# EAGLE design bbf-eurojacks (EAGLE 9.6.2)
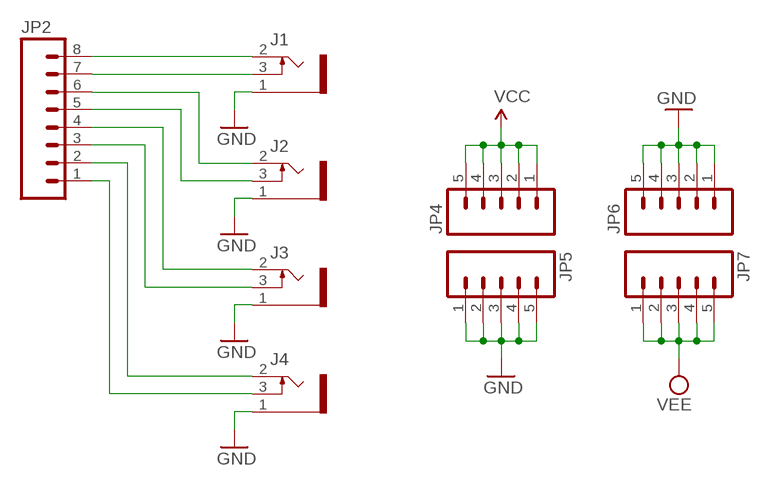
[diagram p0: schematic, sheet 1]

## Parts
J1  1502_03SLOTTED  [1502_03_SLOTTED]
J2  1502_03SLOTTED  [1502_03_SLOTTED]
J3  1502_03SLOTTED  [1502_03_SLOTTED]
J4  1502_03SLOTTED  [1502_03_SLOTTED]
JP2  M08  [1X08]
JP4  M05PTH  [1X05]
JP5  M05PTH  [1X05]
JP6  M05PTH  [1X05]
JP7  M05PTH  [1X05]

## Nets
GND: J1.1 J2.1 J3.1 J4.1 JP5.1 JP5.2 JP5.3 JP5.4 JP5.5 JP6.1 JP6.2 JP6.3 JP6.4 JP6.5
N$1: J2.2 JP2.6
N$2: J2.3 JP2.5
N$3: J3.2 JP2.4
N$4: J3.3 JP2.3
N$5: J4.2 JP2.2
N$6: J4.3 JP2.1
N$7: J1.2 JP2.8
N$8: J1.3 JP2.7
VCC: JP4.1 JP4.2 JP4.3 JP4.4 JP4.5
VEE: JP7.1 JP7.2 JP7.3 JP7.4 JP7.5

## Library data of the parts
J1-J4 = og-lumberg:1502_03
JP2 = SparkFun:M08: Header 8 Standard 8-pin 0.1" header. Use with straight break away headers (SKU : PRT-00116), right angle break away headers (PRT-00553), swiss pins (PRT-00743), machine pins (PRT-00117), and female headers (PRT-00115).
JP4-JP7 = SparkFun:M05: Header 5 Standard 5-pin 0.1" header. Use with straight break away headers (SKU : PRT-00116), right angle break away headers (PRT-00553), swiss pins (PRT-00743), machine pins (PRT-00117), and female headers (PRT-00115). Molex polarized connector foot print use with SKU : PRT-08230 with associated crimp pins and housings.

## Board
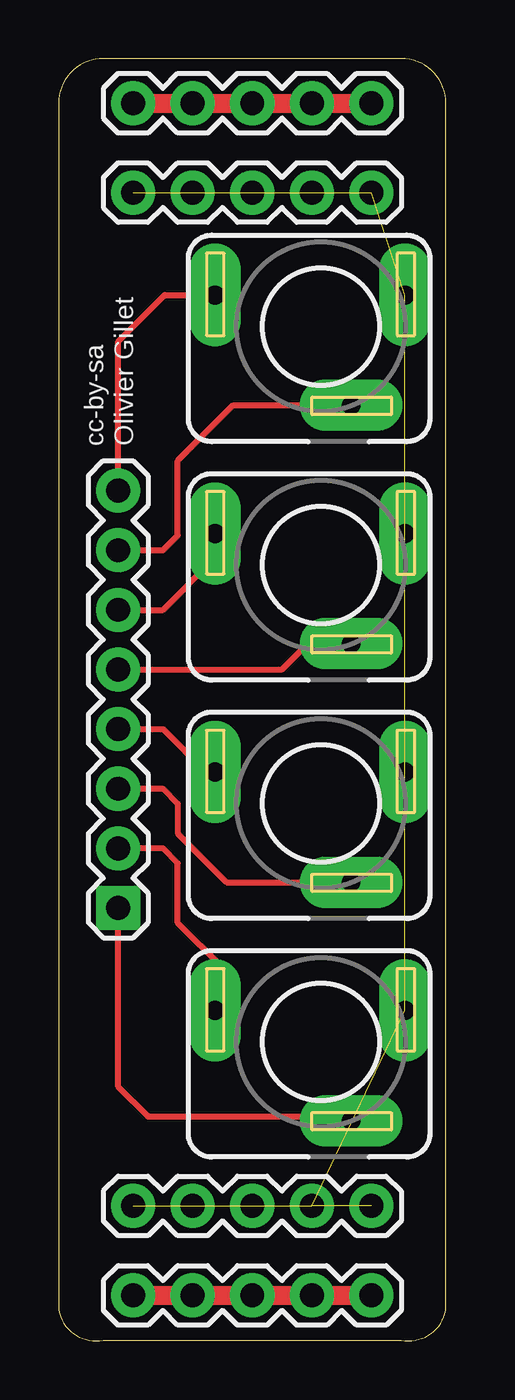
[diagram p1: board, top side]
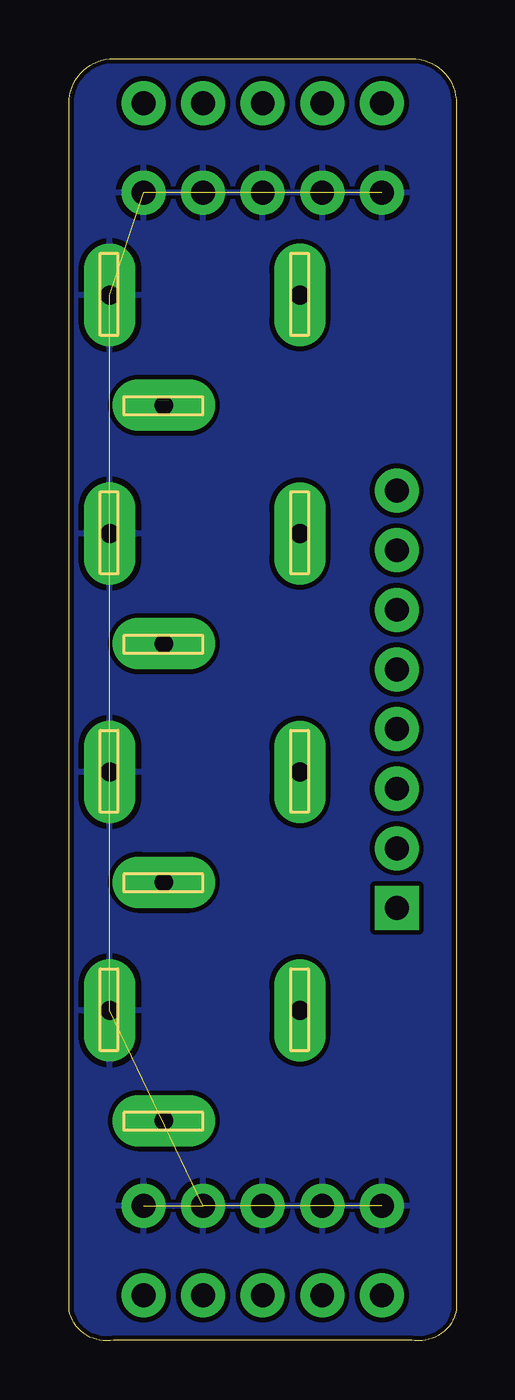
[diagram p2: board, bottom side, seen from below]

Size 16.51 x 54.63 mm. Coordinates in mm from the lower left corner, seen from the top.
Outline: 14.6,0.03 arc90 16.51,1.3 16.51,52.74 arc90 14.62,54.63 1.89,54.63 arc90 0,52.74 0,1.3 arc90 1.91,0.03 14.6,0.03
Copper layers (1*16): Top 0.035mm / dielectric 1.5mm / Bottom 0.035mm
Design rules "SparkFun_10mil *": minimum track width 8mil, minimum drill 20mil, track to track 8mil, track to pad 8mil, pad to pad 8mil, via to via 8mil, smd to smd 8mil, copper to edge 8mil, drill to drill 8mil, minimum pad ring 12mil, minimum via ring 10mil, stop-mask expansion 4mil, vias tented up to drill 25mil, thermal gap 10mil

### Footprints (pad centres in the part's own frame; a part is rotated, then mirrored left to right if it is on the bottom)
1502_03_SLOTTED = drill 0.8 pad 2.184 long: 1 1.35,-3.34; 2 1.35,4.76; 3 -3.35,-1.04
1X08 = drill 1.016 pad 1.88 square: 1 0,0 | drill 1.016 pad 1.88: 2 2.54,0; 3 5.08,0; 4 7.62,0; 5 10.16,0; 6 12.7,0; 7 15.24,0; 8 17.78,0
1X05 = drill 1.016 pad 1.88: 1 0,0; 2 2.54,0; 3 5.08,0; 4 7.62,0; 5 10.16,0

### Placement (x,y rotation side)
J1  11.43,43.21 90 top
J2  11.43,33.05 90 top
J3  11.43,22.89 90 top
J4  11.43,12.73 90 top
JP2  2.54,18.45 90 top
JP4  3.18,52.74 0 top
JP5  3.18,48.93 0 top
JP6  3.18,5.75 0 top
JP7  3.18,1.94 0 top

### Tracks (layer width: path | path; a pad name or v marks a point on that pad's centre or on a via)
GND  (13 unrouted)
  pour Bottom: 15.24,0.03 arc90 16.51,1.3 16.51,52.74 arc90 14.6,54.64 1.91,54.64 arc90 0,52.74 0,1.3 arc90 1.27,0.03
N$1
  Top 0.254: JP2.6 4.45,31.15 6.67,33.37 J2.2
N$2
  Top 0.254: JP2.5 9.53,28.61 10.62,29.7 J2.3
N$3
  Top 0.254: JP2.4 4.45,26.07 6.27,24.24 J3.2
N$4
  Top 0.254: JP2.3 4.45,23.53 5.08,22.89 5.08,21.62 7.16,19.54 J3.3
N$5
  Top 0.254: J4.2 6.99,14.4 6.99,15.91 5.08,17.81 5.08,20.35 4.45,20.99 JP2.2
N$6
  Top 0.254: JP2.1 2.54,10.83 3.81,9.56 10.79,9.56 10.97,9.38 J4.3
N$7
  Top 0.254: JP2.8 2.54,42.58 4.53,44.56 J1.2
N$8
  Top 0.254: JP2.7 4.45,33.69 5.08,34.32 5.08,37.5 7.45,39.86 J1.3
VCC
  Top 0.813: JP4.1 JP4.2 JP4.3 JP4.4 JP4.5
VEE
  Top 0.813: JP7.1 JP7.2 JP7.3 JP7.4 JP7.5

### Text on the board
tNames: cc-by-sa | Olivier Gillet